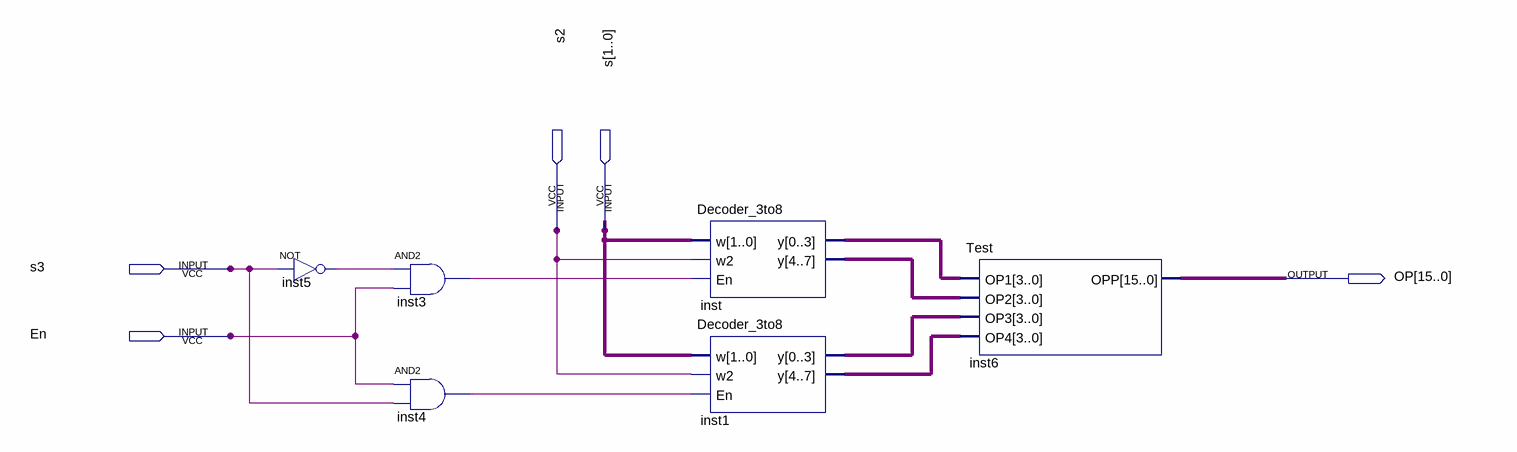
[diagram p0: schematic sheet]
// Quartus schematic Decoder_4to16.bdf as structural Verilog: 6 symbols, 5 pins
module Decoder_4to16 (
  input  s2,
  input  [1:0] s,
  input  s3,
  input  En,
  output [15:0] OP
);

  wire inst3_out, inst4_out, inst5_out;
  wire [3:0] inst1_y, inst1_y_2, inst_y, inst_y_2;

  not inst5 (inst5_out, s3);
  and inst3 (inst3_out, inst5_out, En);
  and inst4 (inst4_out, En, s3);
  Decoder_3to8 inst (
    .w(s), .w2(s2), .En(inst3_out),
    .y({inst_y_2[0], inst_y_2[1], inst_y_2[2], inst_y_2[3], inst_y[0], inst_y[1], inst_y[2], inst_y[3]}));
  Decoder_3to8 inst1 (
    .w(s), .w2(s2), .En(inst4_out),
    .y({inst1_y_2[0], inst1_y_2[1], inst1_y_2[2], inst1_y_2[3], inst1_y[0], inst1_y[1], inst1_y[2], inst1_y[3]}));
  Test inst6 (.OP1(inst_y), .OP2(inst_y_2), .OP3(inst1_y), .OP4(inst1_y_2), .OPP(OP));
endmodule
